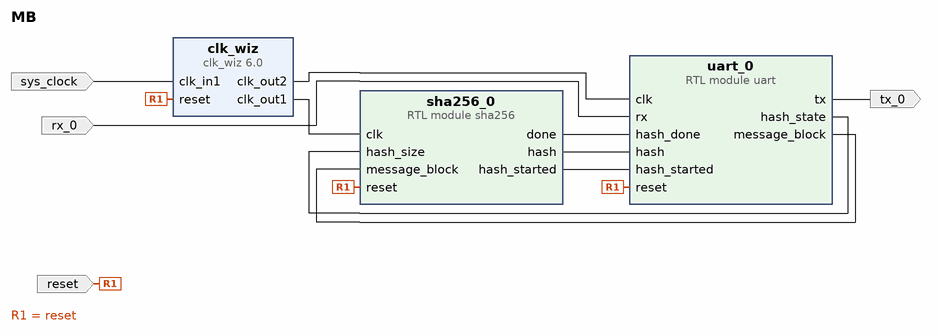
[diagram p0: block diagram of the top level]
# Vivado block design MB, xc7a35tcpg236-1, Vivado 2024.1
create_bd_design MB

create_bd_port -dir I -type clk sys_clock
set_property -dict {CONFIG.FREQ_HZ 100000000 CONFIG.PHASE 0.0} [get_bd_ports sys_clock]
create_bd_port -dir I -type rst reset
set_property -dict {CONFIG.POLARITY ACTIVE_HIGH} [get_bd_ports reset]
create_bd_port -dir I rx_0
create_bd_port -dir O tx_0

create_bd_cell -type module -reference uart uart_0
create_bd_cell -type ip -vlnv xilinx.com:ip:clk_wiz:6.0 clk_wiz
set_property -dict [list \
  CONFIG.CLKOUT1_JITTER 151.636 \
  CONFIG.CLKOUT1_PHASE_ERROR 98.575 \
  CONFIG.CLKOUT1_REQUESTED_OUT_FREQ 50 \
  CONFIG.CLKOUT2_JITTER 130.958 \
  CONFIG.CLKOUT2_PHASE_ERROR 98.575 \
  CONFIG.CLKOUT2_REQUESTED_OUT_FREQ 100 \
  CONFIG.CLKOUT2_USED true \
  CONFIG.CLK_IN1_BOARD_INTERFACE sys_clock \
  CONFIG.MMCM_CLKFBOUT_MULT_F 10.000 \
  CONFIG.MMCM_CLKOUT0_DIVIDE_F 20.000 \
  CONFIG.MMCM_CLKOUT1_DIVIDE 10 \
  CONFIG.MMCM_DIVCLK_DIVIDE 1 \
  CONFIG.NUM_OUT_CLKS 2 \
  CONFIG.RESET_BOARD_INTERFACE reset \
  CONFIG.USE_BOARD_FLOW true \
] [get_bd_cells clk_wiz]
create_bd_cell -type module -reference sha256 sha256_0

# ---- connections ----

connect_bd_net [get_bd_pins clk_wiz/clk_out1] [get_bd_pins sha256_0/clk]
connect_bd_net [get_bd_pins clk_wiz/clk_out2] [get_bd_pins uart_0/clk]
connect_bd_net [get_bd_ports reset] [get_bd_pins clk_wiz/reset] [get_bd_pins sha256_0/reset] [get_bd_pins uart_0/reset]
connect_bd_net -net rx_0_1 [get_bd_ports rx_0] [get_bd_pins uart_0/rx]
connect_bd_net [get_bd_pins sha256_0/done] [get_bd_pins uart_0/hash_done]
connect_bd_net [get_bd_pins sha256_0/hash] [get_bd_pins uart_0/hash]
connect_bd_net [get_bd_pins sha256_0/hash_started] [get_bd_pins uart_0/hash_started]
connect_bd_net [get_bd_ports sys_clock] [get_bd_pins clk_wiz/clk_in1]
connect_bd_net [get_bd_pins uart_0/hash_state] [get_bd_pins sha256_0/hash_size]
connect_bd_net [get_bd_pins uart_0/message_block] [get_bd_pins sha256_0/message_block]
connect_bd_net [get_bd_pins uart_0/tx] [get_bd_ports tx_0]
set_property PFM.CLOCK {clk_out1 {id "1" is_default "true" proc_sys_reset "" status "fixed" freq_hz "50000000"}} [get_bd_cells clk_wiz]

validate_bd_design
save_bd_design
